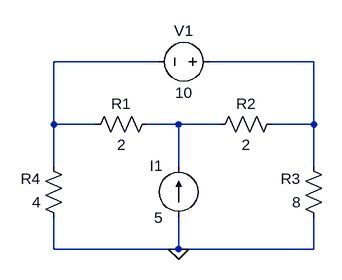
[diagram p0: schematic Draft21.asc]
Draft21.asc, the LTspice schematic file:
Version 4
SHEET 1 880 680
WIRE 160 64 0 64
WIRE 400 64 240 64
WIRE 0 160 0 64
WIRE 64 160 0 160
WIRE 192 160 144 160
WIRE 256 160 192 160
WIRE 400 160 400 64
WIRE 400 160 336 160
WIRE 0 224 0 160
WIRE 192 224 192 160
WIRE 400 224 400 160
WIRE 0 352 0 304
WIRE 192 352 192 304
WIRE 192 352 0 352
WIRE 400 352 400 304
WIRE 400 352 192 352
FLAG 192 352 0
SYMBOL voltage 256 64 R90
WINDOW 0 -32 56 VBottom 2
WINDOW 3 32 56 VTop 2
SYMATTR InstName V1
SYMATTR Value 10
SYMBOL current 192 304 R180
WINDOW 0 24 80 Left 2
WINDOW 3 24 0 Left 2
SYMATTR InstName I1
SYMATTR Value 5
SYMBOL res 160 144 R90
WINDOW 0 0 56 VBottom 2
WINDOW 3 32 56 VTop 2
SYMATTR InstName R1
SYMATTR Value 2
SYMBOL res 352 144 R90
WINDOW 0 0 56 VBottom 2
WINDOW 3 32 56 VTop 2
SYMATTR InstName R2
SYMATTR Value 2
SYMBOL res 416 320 R180
WINDOW 0 36 76 Left 2
WINDOW 3 36 40 Left 2
SYMATTR InstName R3
SYMATTR Value 8
SYMBOL res 16 320 R180
WINDOW 0 36 76 Left 2
WINDOW 3 36 40 Left 2
SYMATTR InstName R4
SYMATTR Value 4

The netlist it stands for:
* Draft21.asc
V1 N002 N001 10
I1 0 N003 5
R1 N003 N001 2
R2 N002 N003 2
R3 0 N002 8
R4 0 N001 4
.backanno
.end